# Altium schematic sheet [1]-COVER_PAGE.SchDoc
size A4
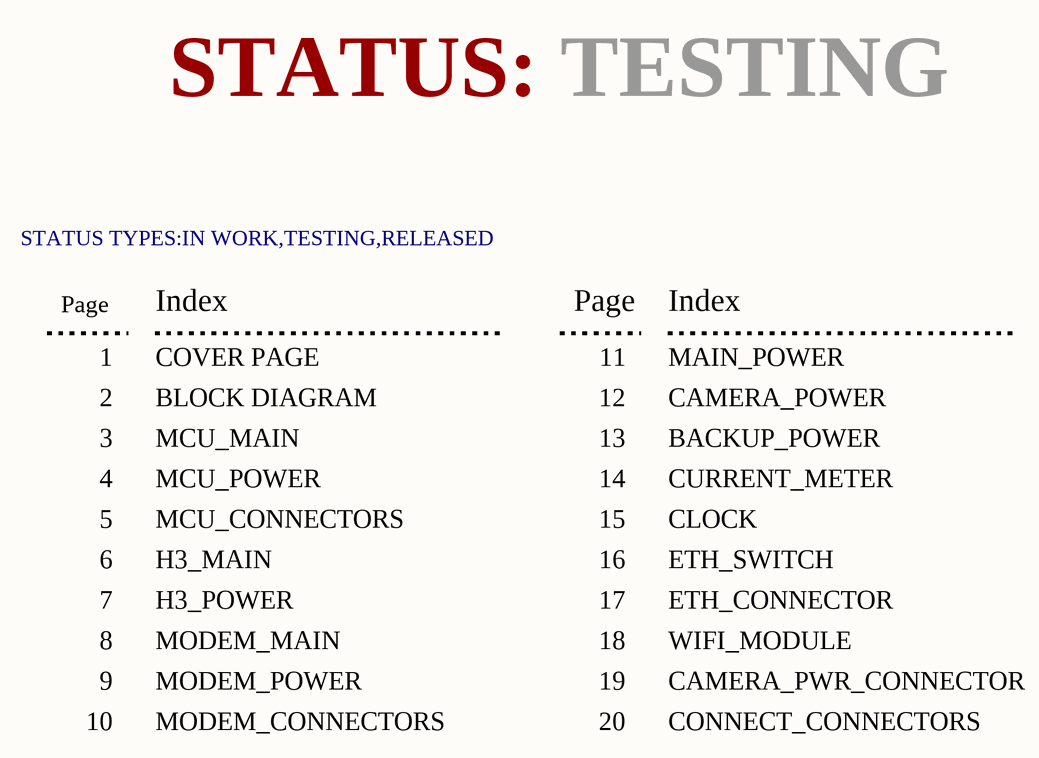
[diagram p0: [1]-COVER_PAGE.SchDoc]

## Notes on the sheet
- STATUS:
- TESTING
- STATUS TYPES:IN WORK,TESTING,RELEASED
- Page
- 1
- Index
- COVER PAGE
- 11
- MAIN_POWER
- 2
- BLOCK DIAGRAM
- 12
- CAMERA_POWER
- 3
- 4
- MCU_MAIN
- MCU_POWER
- 13
- 14
- BACKUP_POWER
- CURRENT_METER
- 5
- 6
- MCU_CONNECTORS
- H3_MAIN
- 15
- 16
- CLOCK
- ETH_SWITCH
- 7
- H3_POWER
- 17
- ETH_CONNECTOR
- 8
- 9
- MODEM_MAIN
- MODEM_POWER
- 18
- 19
- WIFI_MODULE
- CAMERA_PWR_CONNECTOR
- 10
- MODEM_CONNECTORS
- 20
- CONNECT_CONNECTORS